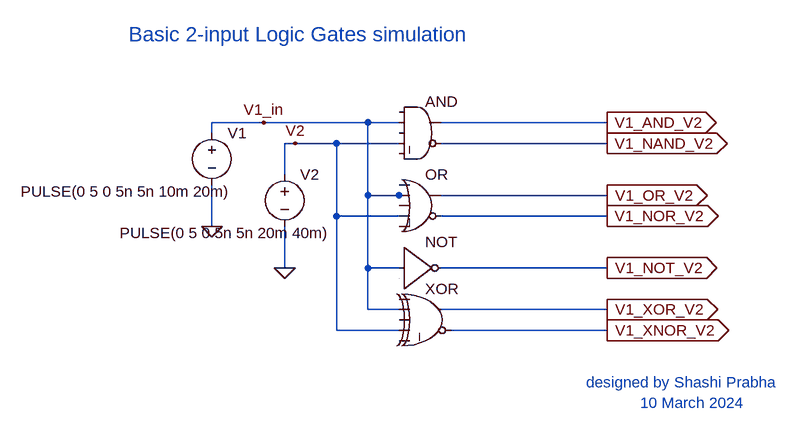
[diagram p0: schematic Basic 2-input Logic Gates simulation.asc]
Basic 2-input Logic Gates simulation.asc, the LTspice schematic file:
Version 4
SHEET 1 1084 680
WIRE 272 192 192 192
WIRE 432 192 272 192
WIRE 480 192 432 192
WIRE 800 192 544 192
WIRE 192 208 192 192
WIRE 320 224 304 224
WIRE 384 224 320 224
WIRE 480 224 384 224
WIRE 800 224 544 224
WIRE 304 272 304 224
WIRE 432 304 432 192
WIRE 480 304 432 304
WIRE 496 304 480 304
WIRE 800 304 544 304
WIRE 384 336 384 224
WIRE 480 336 384 336
WIRE 800 336 544 336
WIRE 192 352 192 288
WIRE 304 416 304 352
WIRE 432 416 432 304
WIRE 480 416 432 416
WIRE 800 416 544 416
WIRE 432 480 432 416
WIRE 480 480 432 480
WIRE 800 480 544 480
WIRE 384 512 384 336
WIRE 480 512 384 512
WIRE 800 512 560 512
FLAG 192 352 0
FLAG 304 416 0
FLAG 800 192 V1_AND_V2
IOPIN 800 192 Out
FLAG 800 224 V1_NAND_V2
IOPIN 800 224 Out
FLAG 800 304 V1_OR_V2
IOPIN 800 304 Out
FLAG 800 336 V1_NOR_V2
IOPIN 800 336 Out
FLAG 800 416 V1_NOT_V2
IOPIN 800 416 Out
FLAG 800 480 V1_XOR_V2
IOPIN 800 480 Out
FLAG 800 512 V1_XNOR_V2
IOPIN 800 512 Out
FLAG 272 192 V1_in
FLAG 320 224 V2
SYMBOL Digital\\and 512 144 R0
SYMATTR InstName AND
SYMBOL Digital\\or 512 256 R0
SYMATTR InstName OR
SYMBOL Digital\\inv 480 352 R0
SYMATTR InstName NOT
SYMBOL Digital\\xor 528 432 R0
SYMATTR InstName XOR
SYMBOL voltage 192 192 R0
WINDOW 3 -294 106 Left 2
WINDOW 123 0 0 Left 0
WINDOW 39 0 0 Left 0
SYMATTR InstName V1
SYMATTR Value PULSE(0 5 0 5n 5n 10m 20m)
SYMBOL voltage 304 256 R0
WINDOW 3 -254 106 Left 2
WINDOW 123 0 0 Left 0
WINDOW 39 0 0 Left 0
SYMATTR InstName V2
SYMATTR Value PULSE(0 5 0 5n 5n 20m 40m)
TEXT 64 56 Left 3 ;Basic 2-input Logic Gates simulation
TEXT 768 592 Left 2 ;designed by Shashi Prabha\n            10 March 2024

The netlist it stands for:
* Basic 2-input Logic Gates simulation.asc
AND 0 V1_in 0 V2 0 V1_NAND_V2 V1_AND_V2 0 AND
A§OR 0 V1_in 0 V2 0 V1_NOR_V2 V1_OR_V2 0 OR
A§NOT V1_in 0 0 0 0 V1_NOT_V2 0 0 BUF
A§XOR 0 V1_in 0 V2 0 V1_XNOR_V2 V1_XOR_V2 0 XOR
V1 V1_in 0 PULSE(0 5 0 5n 5n 10m 20m)
V2 V2 0 PULSE(0 5 0 5n 5n 20m 40m)
* Basic 2-input Logic Gates simulation
* designed by Shashi Prabha
*             10 March 2024
.backanno
.end